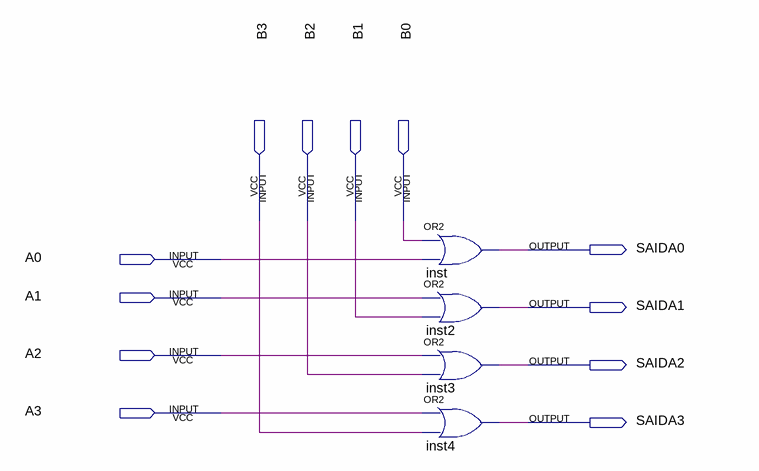
[diagram p0: schematic sheet]
// Quartus schematic ou.bdf as structural Verilog: 4 symbols, 12 pins
module ou (
  input  B3,
  input  B2,
  input  B1,
  input  B0,
  input  A0,
  input  A1,
  input  A2,
  input  A3,
  output SAIDA0,
  output SAIDA1,
  output SAIDA2,
  output SAIDA3
);

  or inst (SAIDA0, B0, A0);
  or inst2 (SAIDA1, A1, B1);
  or inst3 (SAIDA2, A2, B2);
  or inst4 (SAIDA3, A3, B3);
endmodule
